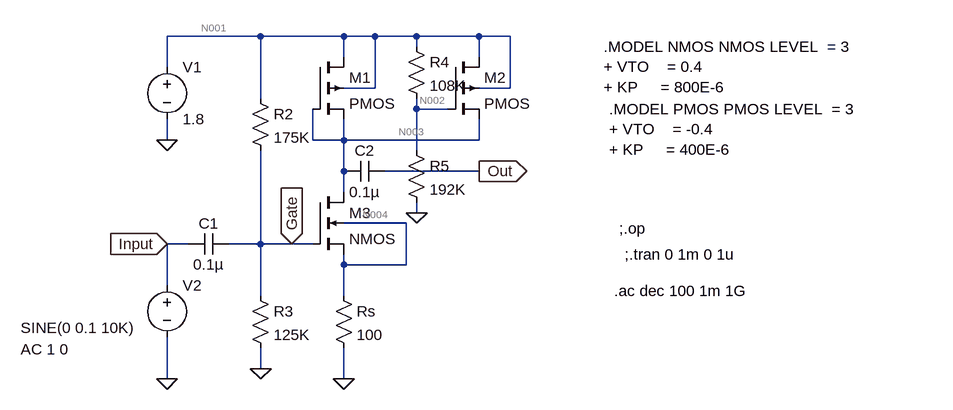
[diagram p0: schematic ass_2_ques_4.asc]
ass_2_ques_4.asc, the LTspice schematic file:
Version 4
SHEET 1 1036 680
WIRE 0 32 -144 32
WIRE 128 32 0 32
WIRE 176 32 128 32
WIRE 240 32 176 32
WIRE 336 32 240 32
WIRE 384 32 336 32
WIRE 240 48 240 32
WIRE 128 64 128 32
WIRE 336 64 336 32
WIRE -144 80 -144 32
WIRE 176 112 176 32
WIRE 176 112 128 112
WIRE 384 112 384 32
WIRE 384 112 336 112
WIRE 0 128 0 32
WIRE 240 144 240 128
WIRE 288 144 240 144
WIRE -144 192 -144 160
WIRE 80 192 80 144
WIRE 128 192 128 160
WIRE 128 192 80 192
WIRE 336 192 336 160
WIRE 336 192 128 192
WIRE 240 208 240 144
WIRE 128 240 128 192
WIRE 336 240 192 240
WIRE 128 272 128 240
WIRE 240 304 240 288
WIRE 224 320 128 320
WIRE -112 352 -144 352
WIRE 0 352 0 208
WIRE 0 352 -48 352
WIRE 48 352 0 352
WIRE 80 352 48 352
WIRE 128 384 128 368
WIRE 224 384 224 320
WIRE 224 384 128 384
WIRE -144 416 -144 352
WIRE 0 432 0 352
WIRE 128 432 128 384
WIRE 0 544 0 512
WIRE -144 560 -144 496
WIRE 128 560 128 512
FLAG 128 560 0
FLAG -144 192 0
FLAG -144 560 0
FLAG 0 544 0
FLAG 240 304 0
FLAG 336 240 Out
IOPIN 336 240 Out
FLAG -144 352 Input
IOPIN -144 352 In
FLAG 48 352 Gate
IOPIN 48 352 In
SYMBOL pmos4 80 64 R0
SYMATTR InstName M1
SYMATTR Value2 l=1u w=40u
SYMBOL pmos4 288 64 R0
SYMATTR InstName M2
SYMATTR Value2 l=1u w=40u
SYMBOL nmos4 80 272 R0
SYMATTR InstName M3
SYMATTR Value2 l=1u w=40u
SYMBOL voltage -144 64 R0
WINDOW 123 0 0 Left 0
WINDOW 39 0 0 Left 0
SYMATTR InstName V1
SYMATTR Value 1.8
SYMBOL res 112 416 R0
SYMATTR InstName Rs
SYMATTR Value 100
SYMBOL voltage -144 400 R0
WINDOW 3 -225 81 Left 2
WINDOW 123 -225 114 Left 2
WINDOW 39 0 0 Left 0
SYMATTR Value SINE(0 0.1 10K)
SYMATTR Value2 AC 1 0
SYMATTR InstName V2
SYMBOL cap -48 336 R90
WINDOW 0 0 32 VBottom 2
WINDOW 3 32 32 VTop 2
SYMATTR InstName C1
SYMATTR Value 0.1µ
SYMBOL res -16 112 R0
SYMATTR InstName R2
SYMATTR Value 175K
SYMBOL res -16 416 R0
SYMATTR InstName R3
SYMATTR Value 125K
SYMBOL res 224 32 R0
SYMATTR InstName R4
SYMATTR Value 108K
SYMBOL res 224 192 R0
SYMATTR InstName R5
SYMATTR Value 192K
SYMBOL cap 192 224 R90
WINDOW 0 0 32 VBottom 2
WINDOW 3 32 32 VTop 2
SYMATTR InstName C2
SYMATTR Value 0.1µ
TEXT 528 48 Left 2 !.MODEL NMOS NMOS LEVEL  = 3                  \n+ VTO    = 0.4      \n+ KP     = 800E-6
TEXT 536 144 Left 2 !.MODEL PMOS PMOS LEVEL  = 3                  \n+ VTO    = -0.4      \n+ KP     = 400E-6
TEXT 552 328 Left 2 !;.op
TEXT 560 368 Left 2 !;.tran 0 1m 0 1u
TEXT 544 424 Left 2 !.ac dec 100 1m 1G

The netlist it stands for:
* ass_2_ques_4.asc
M1 N001 N003 N003 N001 PMOS l=1u w=40u
M2 N001 N002 N003 N001 PMOS l=1u w=40u
M3 N003 Gate N004 N004 NMOS l=1u w=40u
V1 N001 0 1.8
Rs N004 0 100
V2 Input 0 SINE(0 0.1 10K) AC 1 0
C1 Gate Input 0.1µ
R2 N001 Gate 175K
R3 Gate 0 125K
R4 N001 N002 108K
R5 N002 0 192K
C2 Out N003 0.1µ
.model NMOS NMOS
.model PMOS PMOS
.lib standard.mos
.MODEL NMOS NMOS LEVEL  = 3
+ VTO    = 0.4
+ KP     = 800E-6
.MODEL PMOS PMOS LEVEL  = 3
+ VTO    = -0.4
+ KP     = 400E-6
;.op
;.tran 0 1m 0 1u
.ac dec 100 1m 1G
.backanno
.end

* Results of the author's LTspice run, read from the files saved beside the schematic
* Operating Point, zero values left out:
*   V(n001) = 1.8 V
*   V(n003) = 1.148 V
*   V(n002) = 1.152 V
*   V(gate) = 750 mV
*   V(n004) = 100 mV
*   V(out) = 114.8 nV
*   Id(M3) = 1 mA
*   Ib(M3) = -1.058 pA
*   Is(M3) = -1 mA
*   Id(M2) = 492 µA
*   Is(M2) = -492 µA
*   Id(M1) = 508 µA
*   Is(M1) = -508 µA
*   I(R5) = 6 µA
*   I(R4) = 6 µA
*   I(R3) = 6 µA
*   I(R2) = 6 µA
*   I(Rs) = 1 mA
*   I(V1) = -1.012 mA
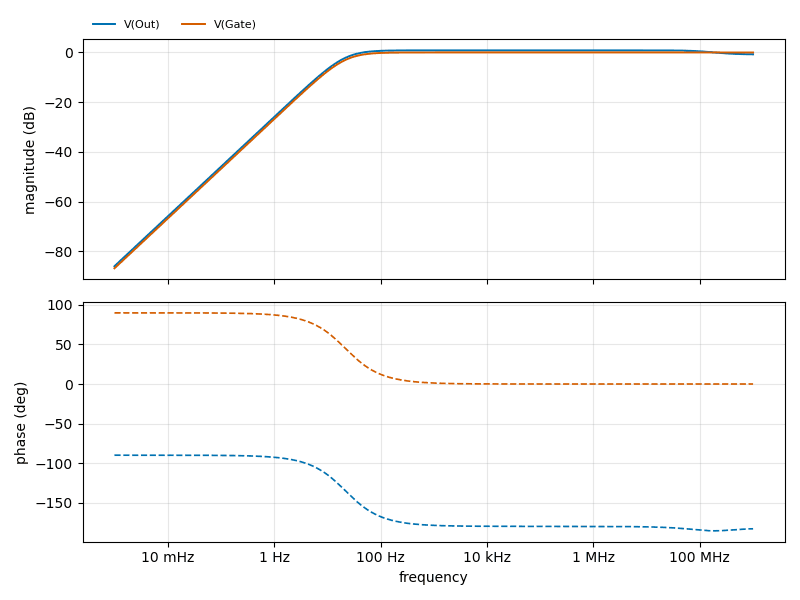
[diagram p1: AC Analysis of ass_2_ques_4.asc, plotted from the saved traces]
* AC Analysis, 1 run:
*   V(Out): -85.93 dB at 1 mHz, -0.75 dB at 1 GHz, peak 0.85 dB at 79.43 kHz, 3 dB below the peak at 21.83 Hz
*   V(Gate): -86.78 dB at 1 mHz, -0.00 dB at 1 GHz, peak -0.00 dB at 1 GHz, 3 dB below the peak at 21.83 Hz